# EAGLE design amplifier-inputside (EAGLE 7.6.0)
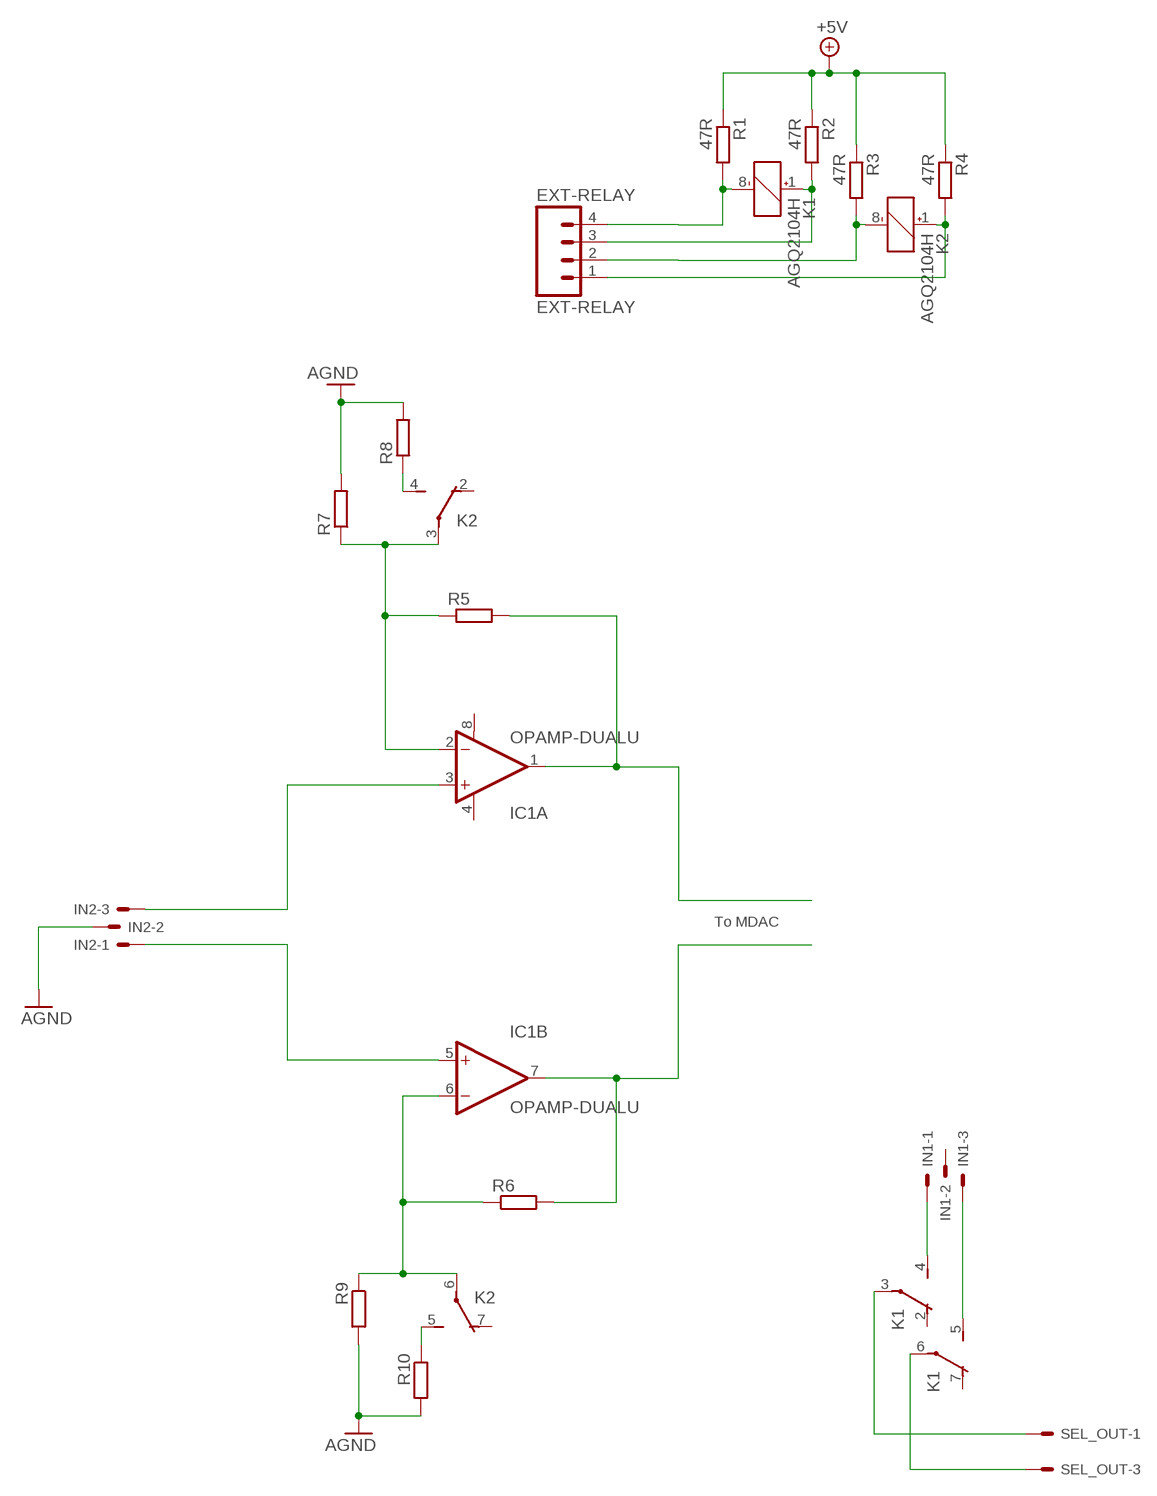
[diagram p0: schematic, sheet 1]

## Parts
EXT-RELAY  EXT-RELAY  M04POLAR  [MOLEX-1X4]
IC1  OPAMP-DUALU  [SO08]
IN1  22-23-2031  [22-23-2031]
IN2  22-23-2031  [22-23-2031]
K1  AGQ2104H  [PCBBOARD]
K2  AGQ2104H  [PCBBOARD]
R1  47R  R-EU_R1206  [R1206]
R2  47R  R-EU_R1206  [R1206]
R3  47R  R-EU_R1206  [R1206]
R4  47R  R-EU_R1206  [R1206]
R5  R-EU_R1206W  [R1206W]
R6  R-EU_R1206W  [R1206W]
R7  R-EU_R1206W  [R1206W]
R8  R-EU_R1206W  [R1206W]
R9  R-EU_R1206W  [R1206W]
R10  R-EU_R1206W  [R1206W]
SEL_OUT  22-23-2031  [22-23-2031]

## Nets
+5V: R1.1 R2.1 R3.1 R4.1
AGND: IN2.2 R7.2 R8.2 R9.2 R10.2
INL: K1.3(P) SEL_OUT.1
INR: K1.6(P) SEL_OUT.3
N$1: IN1.1 K1.4(S)
N$2: IC1.3(A:+IN) IN2.3
N$3: IN1.3 K1.5(S)
N$4: IC1.5(B:+IN) IN2.1
N$5: K1.8(-) R1.2
N$6: K2.4(S) R8.1
N$7: IC1.1(A:OUT) R5.2
N$8: K1.1(+) R2.2
N$9: K2.8(-) R3.2
N$10: IC1.7(B:OUT) R6.2
N$11: EXT-RELAY.1
N$12: K2.1(+) R4.2
N$13: IC1.2(A:-IN) K2.3(P) R5.1 R7.1
N$15: EXT-RELAY.2
N$16: EXT-RELAY.4
N$17: K2.5(S) R10.1
N$18: IC1.6(B:-IN) K2.6(P) R6.1 R9.1
N$23: EXT-RELAY.3
Unconnected: IN1.2 K1.2(O) K1.7(O) K2.2(O) K2.7(O) SEL_OUT.2

## Notes on the sheet
- To MDAC

## Power pins joined to a net without a drawn wire
V+: IC1.8(A:V+)
V-: IC1.4(A:V-)

## Library data of the parts
EXT-RELAY = SparkFun-Connectors:M04: Header 4 Standard 4-pin 0.1" header. Use with straight break away headers (SKU : PRT-00116), right angle break away headers (PRT-00553), swiss pins (PRT-00743), machine pins (PRT-00117), and female headers (PRT-00115). Molex polarized connector foot print use with SKU : PRT-08231 with associated crimp pins and housings. 1MM SMD Version SKU: PRT-10208
IC1 = SparkFun-AnalogIC:OPAMP-DUAL: Generic op-amp footprint
IN1 IN2 SEL_OUT = con-molex:22-23-2031: .100" (2.54mm) Center Header - 3 Pin; MF: MOLEX; MPN: 22-23-2031; OC_FARNELL: 1462950; OC_NEWARK: 30C0862
K1 K2 = panasonic-agq:AGQ2104H: Panasonic AGQ RELAYS High sensitivity single side stable type (Nominal operating power: 100mW) is available Outstanding surge resistance The use of twin crossbar contacts ensures high contact reliability Datasheet URL: http://www3.panasonic.biz/ac/e_download/control/relay/signal/catalog/mech_eng_gq.pdf
R1-R10 = rcl:R-EU_: RESISTOR, European symbol

## Board
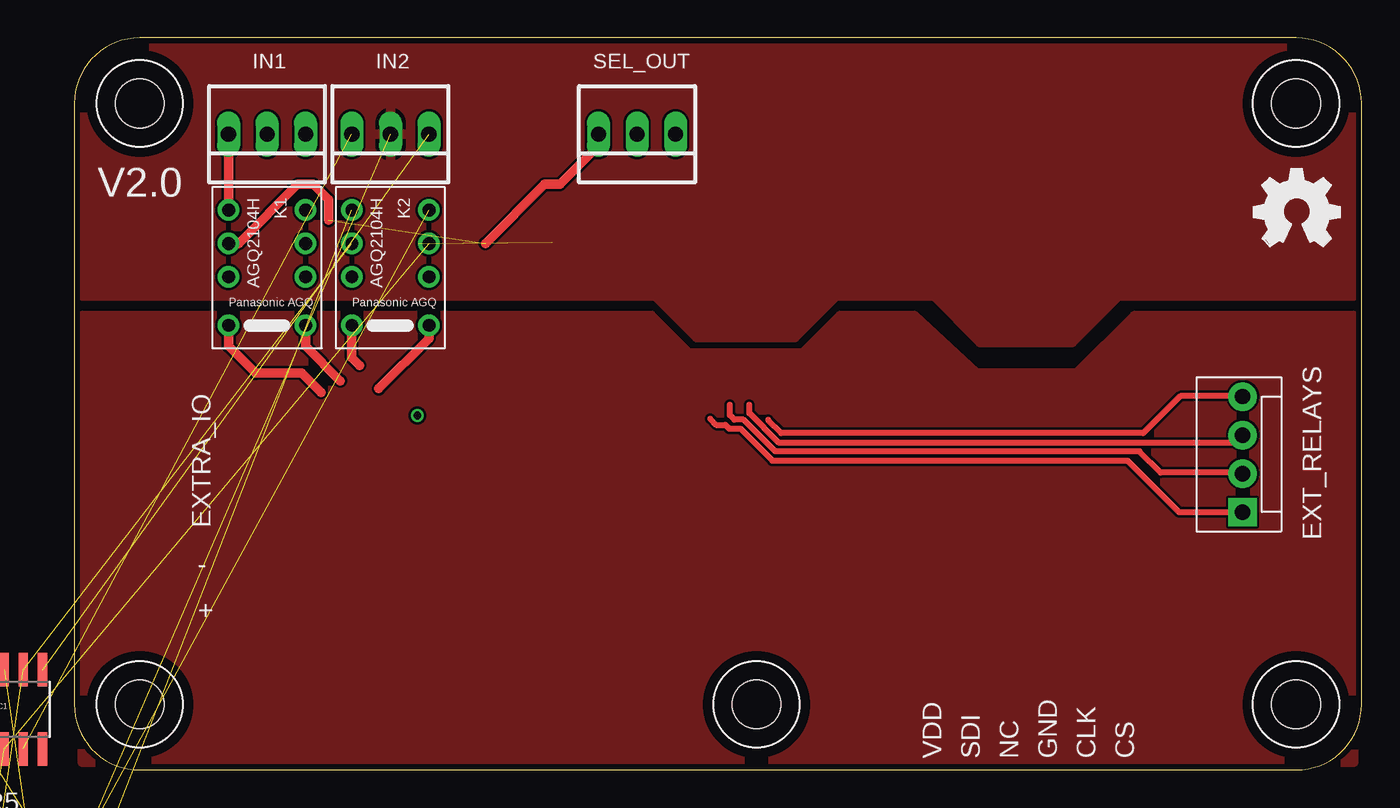
[diagram p1: board, top side]
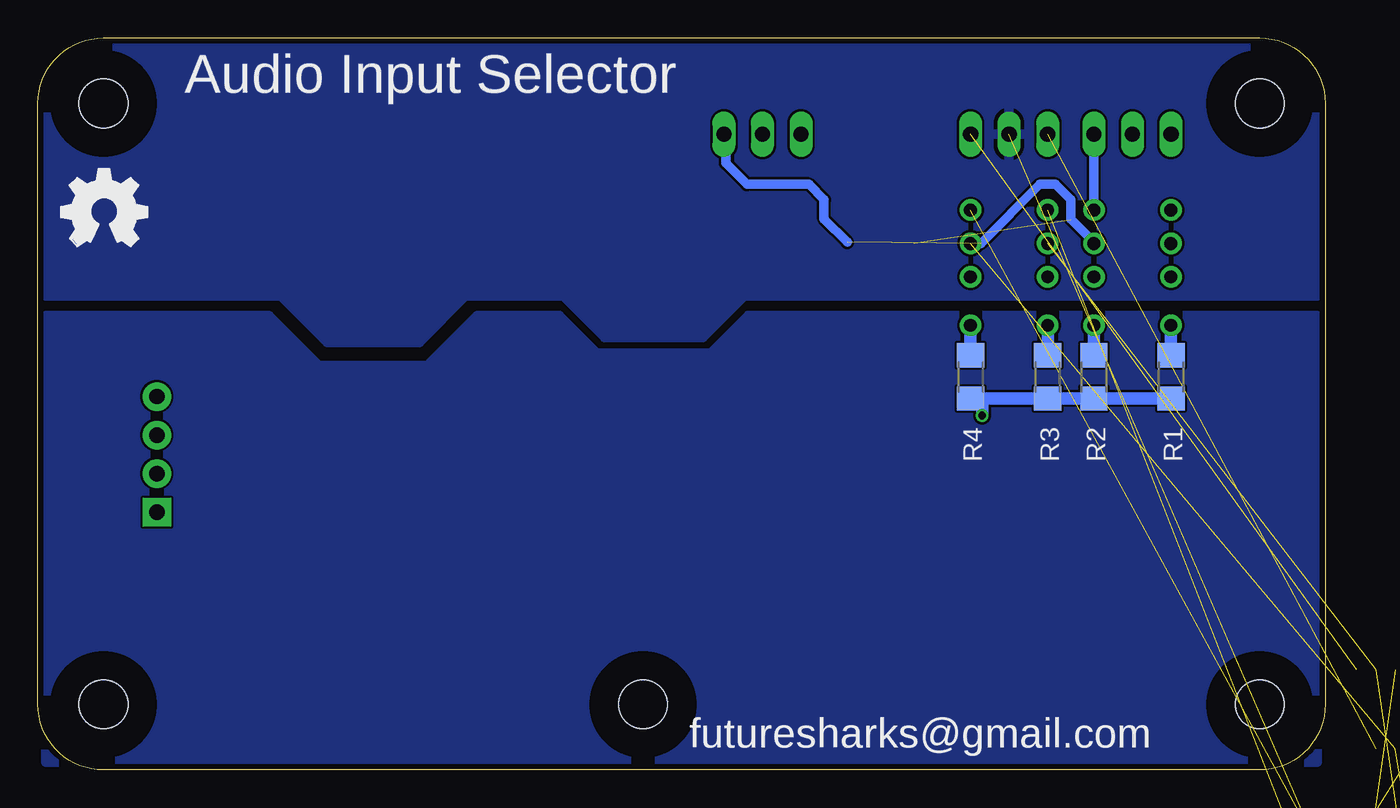
[diagram p2: board, bottom side, seen from below]

Size 84.84 x 48.26 mm. Coordinates in mm from the lower left corner, seen from the top.
Outline: 4.32,0 80.52,0 arc90 84.84,4.32 84.84,43.94 arc90 80.52,48.26 4.32,48.26 arc90 0,43.94 0,4.32 arc90 4.32,0
Copper layers (1*16): Top 0.0356mm / dielectric 1.5011mm / Bottom 0.0356mm
Design rules "LaenPCBOrder": minimum track width 6mil, minimum drill 13mil, track to track 6mil, track to pad 6mil, pad to pad 6mil, via to via 6mil, smd to smd 6mil, copper to edge 15mil, drill to drill 6mil, minimum pad ring 7mil, minimum via ring 7mil, stop-mask expansion 3mil, vias tented up to drill 0mil, thermal gap 10mil

### Footprints (pad centres in the part's own frame; a part is rotated, then mirrored left to right if it is on the bottom)
MOLEX-1X4 = drill 1.016 pad 1.88 square: 1 0,0 | drill 1.016 pad 1.88: 2 2.54,0; 3 5.08,0; 4 7.62,0
SO08 = smd 0.61 x 2.21: 1 -1.905,-2.616; 2 -0.635,-2.616; 3 0.635,-2.616; 4 1.905,-2.616; 5 1.905,2.616; 6 0.635,2.616; 7 -0.635,2.616; 8 -1.905,2.616
22-23-2031 = drill 1 long: 1 -2.54,0; 2 0,0; 3 2.54,0
PCBBOARD = drill 0.85 pad 1.422: 1 -2.54,3.2; 2 -2.54,0; 3 -2.54,-2.2; 4 -2.54,-4.4; 5 2.54,-4.4; 6 2.54,-2.2; 7 2.54,0; 8 2.54,3.2
R1206 = smd 1.6 x 1.803: 1 -1.422,0; 2 1.422,0
R1206W = smd 1.8 x 1.2: 1 -1.499,0; 2 1.499,0
M3_HOLE = hole 3.2: 0,0

### Placement (x,y rotation side)
EXT-RELAY  77,17 90 top
IC1  -4,4 0 top
IN1  12.7,41.91 180 top
IN2  20.83,41.91 180 top
K1  12.7,32.51 180 top
K2  20.83,32.51 180 top
LOGO1  OSHW_LOGO_FILLX0200-NT  [OSHW_FILLX200_NOTEXT]  83.31,34.54 0 bottom
LOGO2  OSHW_LOGO_FILLX0200-NT  [OSHW_FILLX200_NOTEXT]  77.72,34.54 0 top
R1  10.16,25.91 90 bottom
R2  15.24,25.91 90 bottom
R3  18.29,25.91 90 bottom
R4  23.37,25.91 90 bottom
R5  -4,-4 0 top  (outside the outline)
R6  -4,-8 0 top  (outside the outline)
R7  -4,-12 0 top  (outside the outline)
R8  -4,-16 0 top  (outside the outline)
R9  -4,-20 0 top  (outside the outline)
R10  -4,-24 0 top  (outside the outline)
SEL_OUT  37.08,41.91 180 top
U$1  [M3_HOLE]  4.32,43.94 0 top
U$2  [M3_HOLE]  4.32,4.32 0 top
U$3  [M3_HOLE]  44.96,4.32 0 top
U$4  [M3_HOLE]  80.52,4.32 0 top
U$5  [M3_HOLE]  80.52,43.94 0 top

### Tracks (layer width: path | path; a pad name or v marks a point on that pad's centre or on a via)
+5V  (via drill 0.5)
  Bottom 0.61: R4.1 23,24.49 22.61,24.09 | 22.61,24.38 18.39,24.38 R3.1
  Bottom 0.813: R1.1 R2.1 R3.1 R4.1 | v22.61,23.37 22.61,24.09 22.61,24.38
AGND  (4 unrouted)
  pour Bottom: 0.51,47.75 0.51,31.24 38.26,31.24 41,28.5 47.5,28.5 50.24,31.24 56.64,31.24 59.69,28.19 65.79,28.19 68.83,31.24 84.33,31.24 84.33,47.75
  pour Top: 84.33,47.75 84.33,31.24 68.83,31.24 65.79,28.19 59.69,28.19 56.64,31.24 50.24,31.24 47.5,28.5 41,28.5 38.26,31.24 0.51,31.24 0.51,47.75
DGND
  pour Bottom: 0.51,29.97 0.51,0.51 84.33,0.51 84.33,29.97 69.6,29.97 66.29,26.67 59.18,26.67 55.88,29.97 50.47,29.97 48,27.5 40.5,27.5 38,30
  pour Top: 0.51,29.97 0.51,0.51 84.33,0.51 84.33,29.97 69.85,29.97 66.04,26.16 59.44,26.16 55.37,29.97 50.47,29.97 48,27.5 40.5,27.5 38,30
INL  (1 unrouted)
  Bottom 0.61: K1.3 15.24,34.8 16.76,36.32 16.76,37.59 17.78,38.61 18.8,38.61 22.69,34.71 | 31.5,34.8 33.02,36.32 33.02,37.59 34.04,38.61 38.11,38.61 39.5,40 39.5,41.79 SEL_OUT.1
INR  (1 unrouted)
  Top 0.61: K1.6 10.84,34.71 14.73,38.61 15.75,38.61 16.76,37.59 16.76,36.24 | 27.09,34.71 30.99,38.61 32,38.61 34.54,41.15 SEL_OUT.3
N$1
  Bottom 0.61: K1.4 IN1.1
N$2  (1 unrouted)
N$3
  Top 0.61: K1.5 IN1.3
N$4  (1 unrouted)
N$5
  Top 0.61: 16.26,24.89 14.99,26.16 11.94,26.16 10.16,27.94 K1.8
  Bottom 0.813: R1.2 K1.8
N$6  (1 unrouted)
N$7  (1 unrouted)
N$8
  Top 0.61: 17.53,25.65 15.24,27.94 K1.1
  Bottom 0.813: R2.2 K1.1
N$9
  Top 0.61: 18.8,26.67 18.29,27.18 K2.8
  Bottom 0.813: R3.2 K2.8
N$10  (1 unrouted)
N$11
  Top 0.406: 41.91,23.14 42.3,22.75 42.9,22.75 43.15,22.5 43.9,22.5 46,20.4 69.4,20.4 72.8,17 EXT-RELAY.1
N$12
  Top 0.61: 20.07,25.15 23.37,28.45 K2.1
  Bottom 0.813: R4.2 K2.1
N$13  (3 unrouted)
N$15
  Top 0.406: EXT-RELAY.2 76.94,19.6 71.6,19.6 70.2,21 46.2,21 44.1,23.1 43.5,23.1 43.2,23.4 43.2,24.07
N$16
  Top 0.406: EXT-RELAY.4 76.97,24.65 72.9,24.65 70.45,22.2 46.6,22.2 45.72,23.08
N$17  (1 unrouted)
N$18  (3 unrouted)
N$23
  Top 0.406: EXT-RELAY.3 76.52,21.6 46.4,21.6 44.48,23.52 44.48,24.06

### Text on the board
tPlace: EXT_RELAYS | EXTRA_IO
tNames: V2.0 | - | + | VDD | SDI | NC | GND | CLK | CS
bNames: Audio Input Selector | futuresharks@gmail.com